# EAGLE schematic usb-interface (EAGLE 9.6.2)
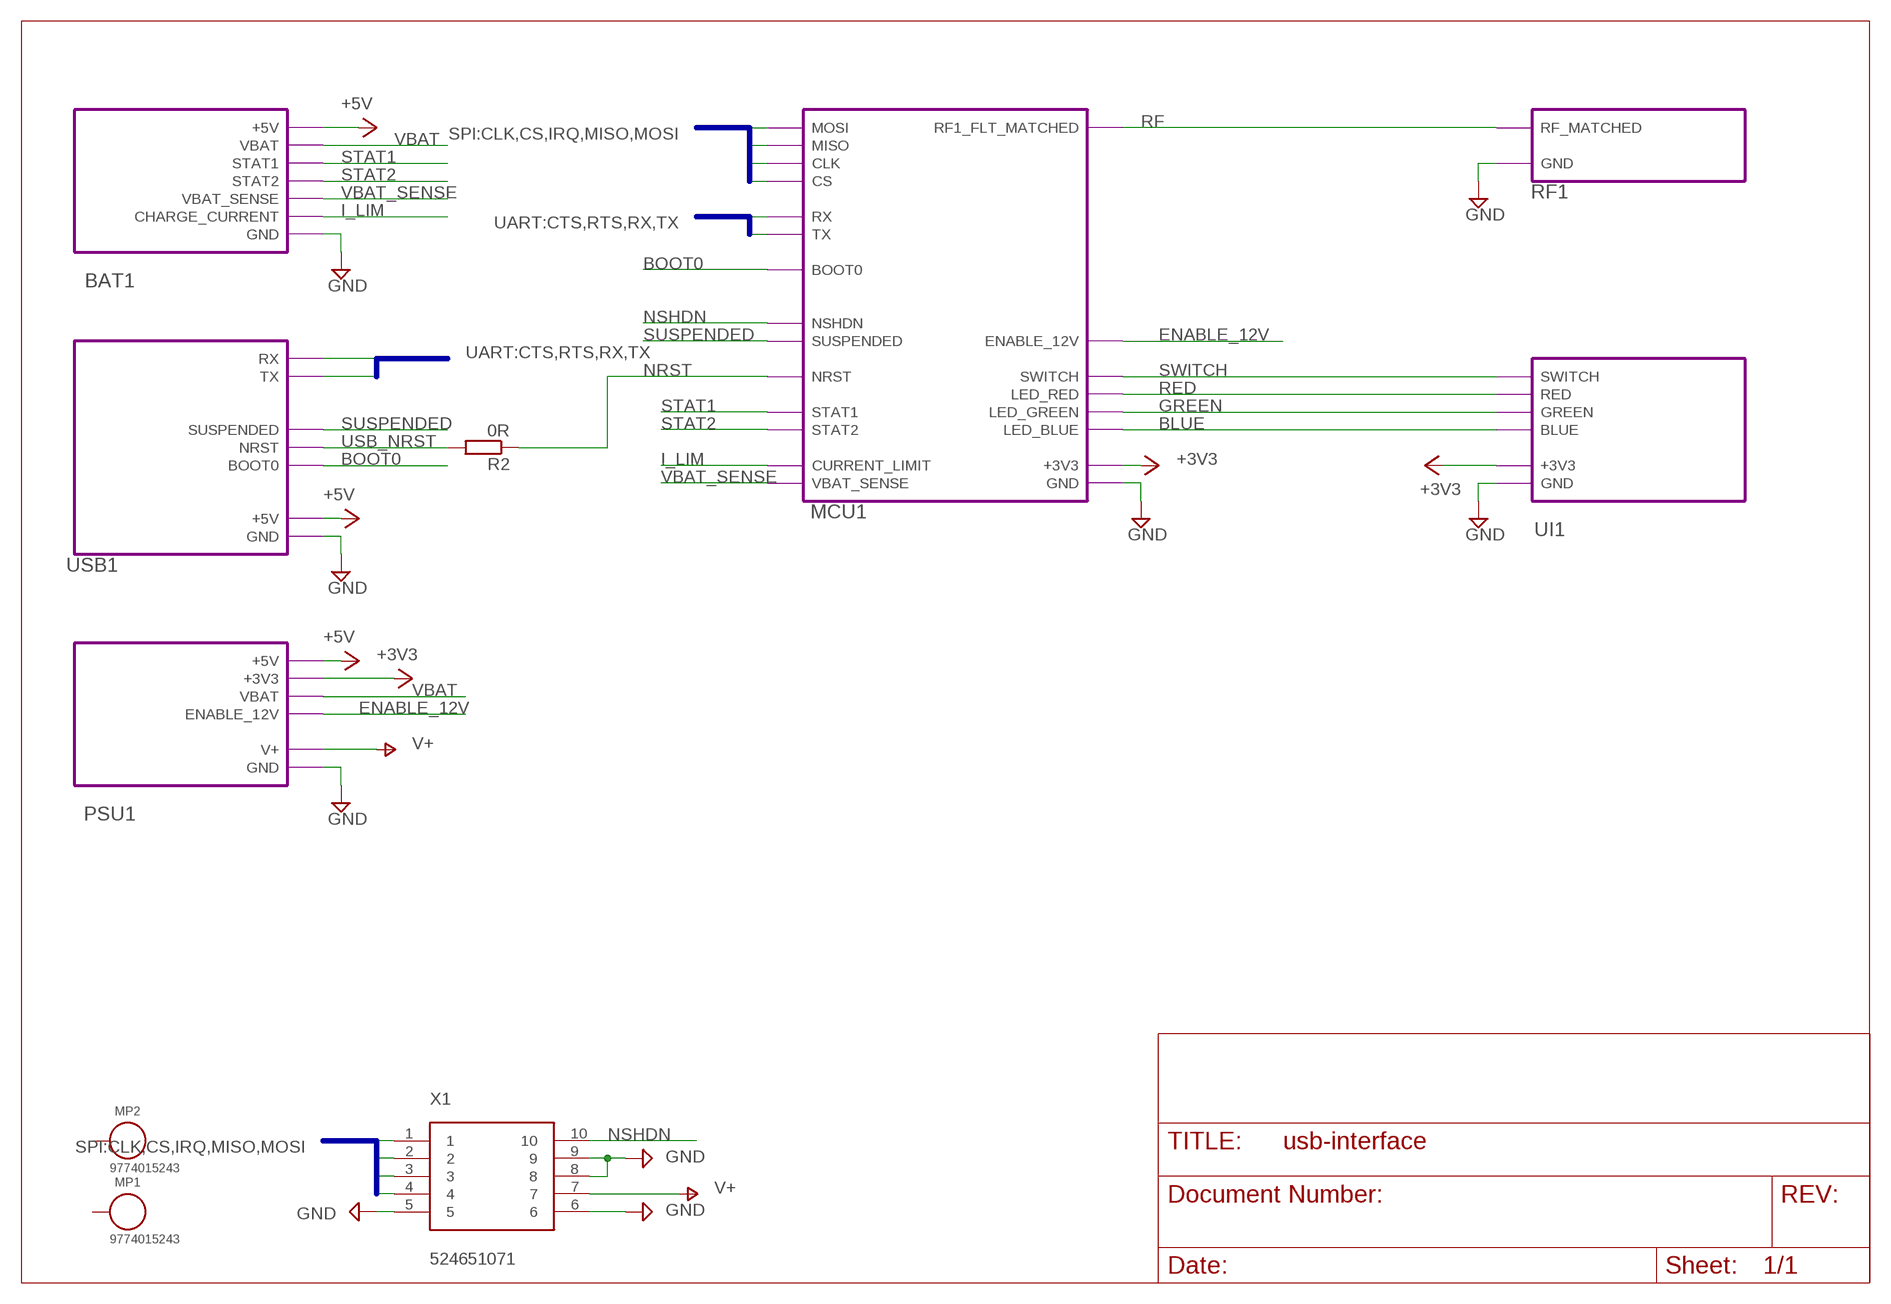
[diagram p0: schematic, sheet 1]

## Parts
MP1  9774015243  WA-SMSI_9774XXX243_9774015243  [WA-SMSI_9774015243]
MP2  9774015243  WA-SMSI_9774XXX243_9774015243  [WA-SMSI_9774015243]
R2  0R  R-EU_R0402  [R0402]
X1  524651071  524651071SMD  [524651071]

## Module instances
BAT1 = BATTERY
RF1 = WIRELESS
PSU1 = POWERSUPPLY
MCU1 = MICROCONTROLLER
USB1 = USB
UI1 = INTERFACE

## Nets
+3V3: port MCU1.+3V3 PSU1.+3V3 UI1.+3V3
+5V: port USB1.+5V BAT1.+5V PSU1.+5V
BLUE: port MCU1.LED_BLUE UI1.BLUE
BOOT0: port MCU1.BOOT0 USB1.BOOT0
CLK: X1.3 ; port MCU1.CLK
CS: X1.4 ; port MCU1.CS
ENABLE_12V: port PSU1.ENABLE_12V MCU1.ENABLE_12V
GND: X1.5 X1.6 X1.8 X1.9 ; port MCU1.GND RF1.GND USB1.GND BAT1.GND PSU1.GND UI1.GND
GREEN: port MCU1.LED_GREEN UI1.GREEN
I_LIM: port MCU1.CURRENT_LIMIT BAT1.CHARGE_CURRENT
MISO: X1.2 ; port MCU1.MISO
MOSI: X1.1 ; port MCU1.MOSI
NRST: R2.1 ; port MCU1.NRST
NSHDN: X1.10 ; port MCU1.NSHDN
RED: port MCU1.LED_RED UI1.RED
RF [50Ohm]: port RF1.RF_MATCHED MCU1.RF1_FLT_MATCHED
RX: port MCU1.RX USB1.RX
STAT1: port MCU1.STAT1 BAT1.STAT1
STAT2: port MCU1.STAT2 BAT1.STAT2
SUSPENDED: port MCU1.SUSPENDED USB1.SUSPENDED
SWITCH: port MCU1.SWITCH UI1.SWITCH
TX: port MCU1.TX USB1.TX
USB_NRST: R2.2 ; port USB1.NRST
V+: X1.7 ; port PSU1.V+
VBAT: port PSU1.VBAT BAT1.VBAT
VBAT_SENSE: port MCU1.VBAT_SENSE BAT1.VBAT_SENSE
Unconnected: MP1.1 MP2.1

## Buses
SPI:CLK,CS,IRQ,MISO,MOSI
UART:CTS,RTS,RX,TX

## Library data of the parts
MP1 MP2 = Wurth_Assembly_WA-SMSI:WA-SMSI_9774XXX243: WA-SMSI SMT Steel Spacer, M2 Thread Internal PROPERTIES Material Steel Surface Tin GENERAL INFORMATION Operating Temperature -55 up to +150 °C PACKAGING PROPERTIES Packaging Bag;​ Tape and Reel Packaging Unit 1050 <https://katalog.we-online.de/media/images/v2/o92910v209%20Family_WA-SMSI_M2-M2.5.jpg> Details see: https://katalog.we-online.de/en/em/SMSI_SMT_STEEL_SPACER_M2_THREAD_INTERNAL Updated by Ella Wu 2020-05-18 2020(C) Wurth Elektronik; DATASHEET-URL: https://www.we-online.de/katalog/datasheet/9774015243.pdf; INNER-DIAMETER: 2.8mm; INNER-THREAD-LENGTH: -; OUTER-DIAMETER: 4.35mm; PART-NUMBER: 9774015243; PIN-LENGTH: 1.5mm; THREAD: M2
R2 = rcl:R-EU_: RESISTOR, European symbol; SPICEPREFIX: R
X1 = connectors:524651071: 524651071 SlimStack Board-to-Board Connector, 0.80mm Pitch, Floating Series, Rigid Type Receptacle, 4.50 to 7.00mm Mated Height, 10 Circuits, without Boss

## Module BATTERY
Ports: GND(io) CHARGE_CURRENT(io) VBAT_SENSE(io) +5V(io) VBAT(io) STAT1(io) STAT2(io)
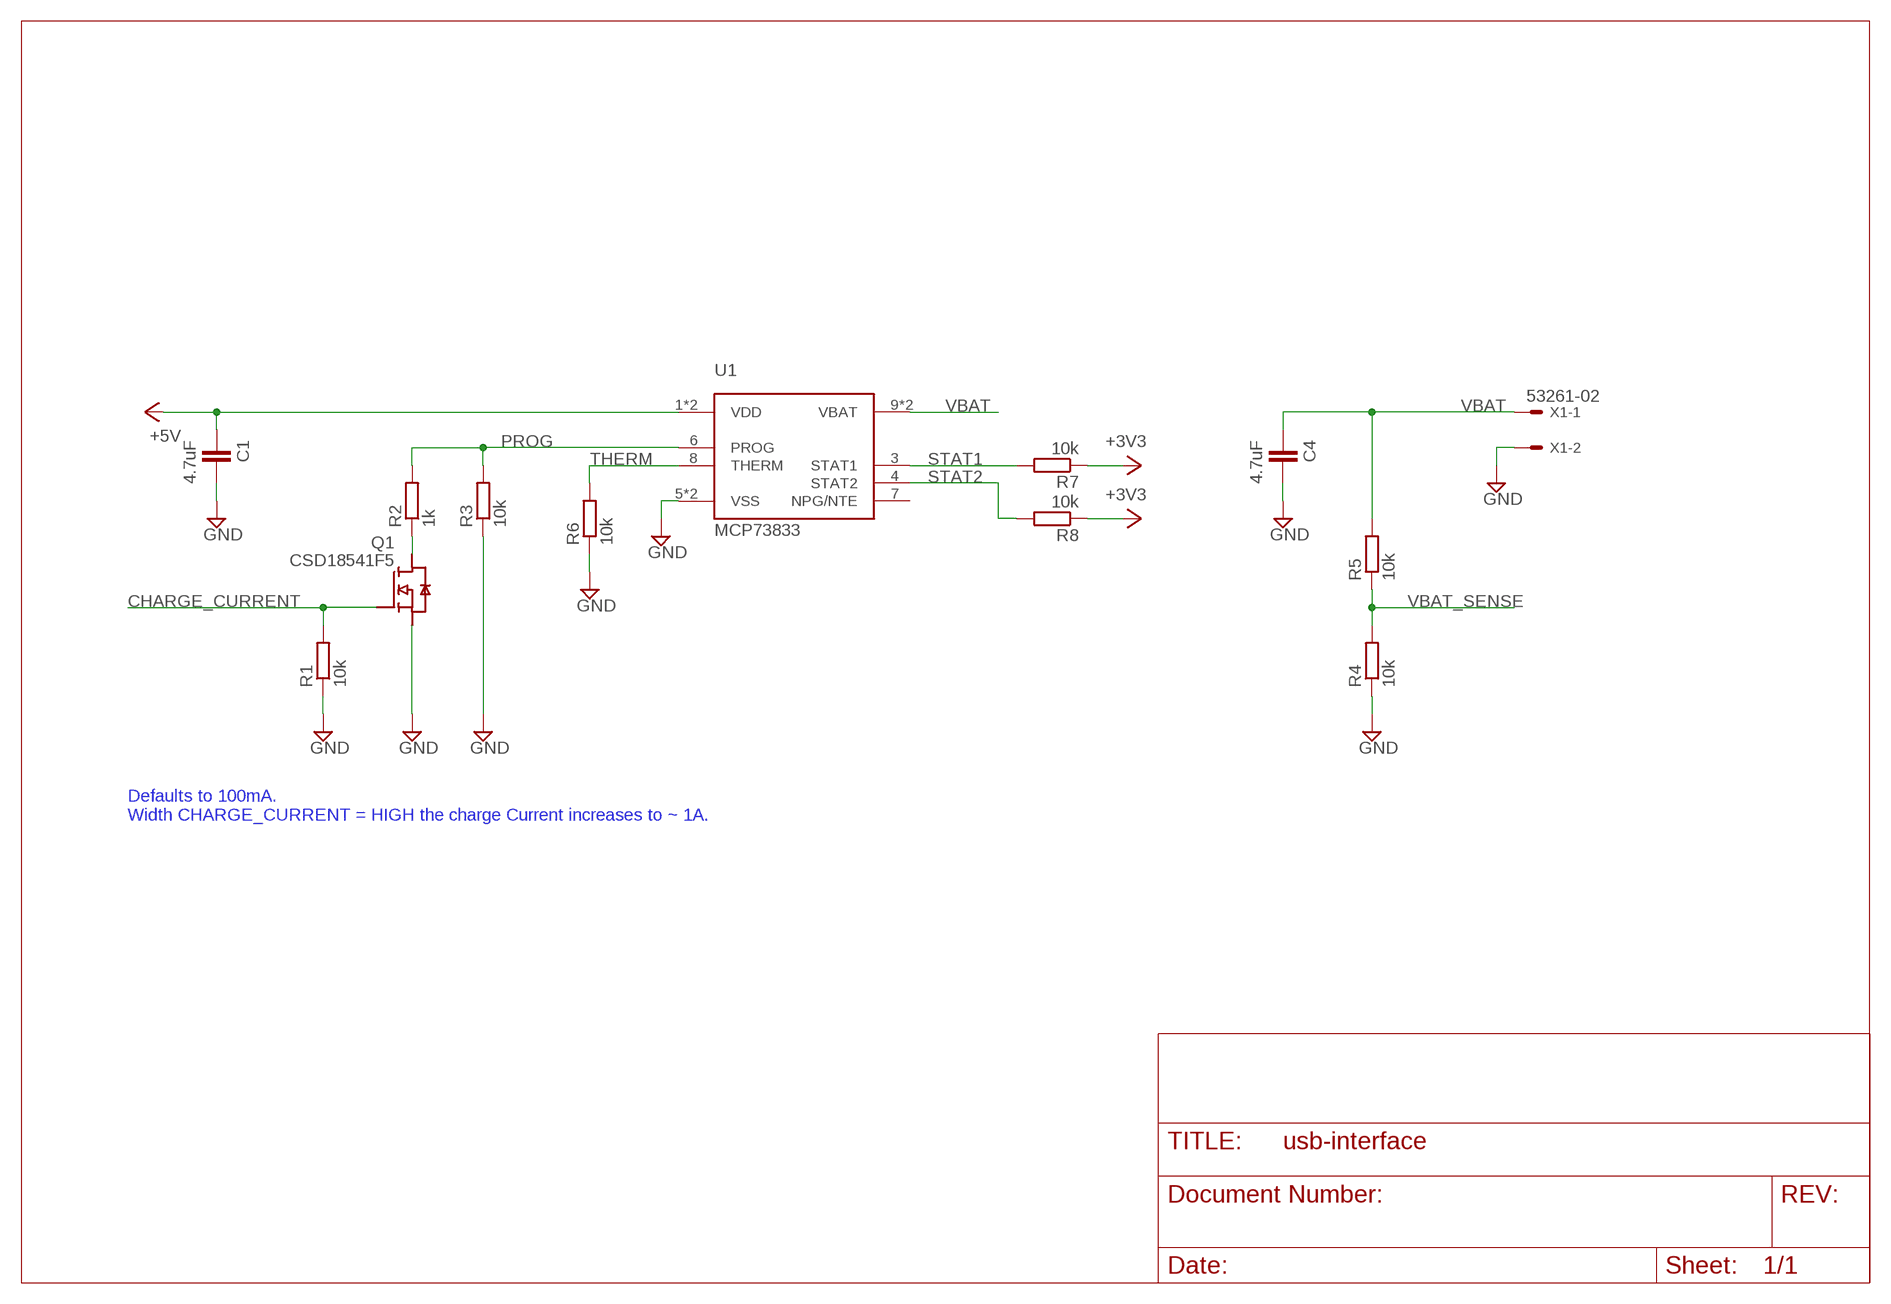
[diagram p1: schematic, module BATTERY, sheet 1]

### Parts
C1  4.7uF  C-EUC0603K  [C0603K]
C4  4.7uF  C-EUC0603K  [C0603K]
Q1  CSD18541F5  CSD18541F5LGA  [CSD18541F5]
R1  10k  R-EU_R0402  [R0402]
R2  1k  R-EU_R0402  [R0402]
R3  10k  R-EU_R0402  [R0402]
R4  10k  R-EU_R0402  [R0402]
R5  10k  R-EU_R0402  [R0402]
R6  10k  R-EU_R0402  [R0402]
R7  10k  R-EU_R0402  [R0402]
R8  10k  R-EU_R0402  [R0402]
U1  MCP73833  MCP73833/4DFN10  [SON50P300X300X100-11T140X220N]
X1  53261-02  [53261-02]

### Nets
+3V3: R7.1 R8.1
+5V: C1.1 U1.1(VDD) U1.2(VDD)
CHARGE_CURRENT: Q1.1(G) R1.2
GND: C1.2 C4.2 Q1.2(S) R1.1 R3.1 R4.1 R6.1 U1.5(VSS) U1.11(VSS) X1.2
N$1: Q1.3(D) R2.1
PROG: R2.2 R3.2 U1.6(PROG)
STAT1: R7.2 U1.3(STAT1)
STAT2: R8.2 U1.4(STAT2)
THERM: R6.2 U1.8(THERM)
VBAT: C4.1 R5.2 U1.9(VBAT) U1.10(VBAT) X1.1
VBAT_SENSE: R4.2 R5.1
Unconnected: U1.7(NPG/NTE)

### Notes on the sheet
- Defaults to 100mA.
  Width CHARGE_CURRENT = HIGH the charge Current increases to ~ 1A.

### Library data of the parts
C1 C4 = rcl:C-EU: CAPACITOR, European symbol; SPICEPREFIX: C
Q1 = spectrometer:CSD18541F5: CSD18541F5 This 54-mΩ, 60-V, N-Channel FemtoFETTM MOSFET technology is designed and optimized to minimize the footprint in many space constrained industrial load switch applications. This technology is capable of replacing standard small signal MOSFETs while providing a significant reduction in footprint size.
R1-R8 = rcl:R-EU_: RESISTOR, European symbol; SPICEPREFIX: R
U1 = spectrometer:MCP73833/4: MCP73833/4 The MCP73833/4 is a highly advanced linear charge management controller for use in space-limited, cost sensitive applications. The MCP73833/4 is available in a 10-Lead, 3 mm x 3 mm DFN package or a 10-Lead, MSOP package. Along with its small physical size, the low number of external components required makes the MCP73833/4 ideally suited for portable applications. For applications charging from a USB port, the MCP73833/4 can adhere to all the specifications governing the USB power bus. The MCP73833/4 employs a constant current/constant voltage charge algorithm with selectable precondition- ing and charge termination. The constant voltage regulation is fixed with four available options: 4.20V, 4.35V, 4.40V, or 4.50V, to accomodate new, emerging battery charging requirements. The constant current value is set with one external resistor. The MCP73833/ 4 limits the charge current based on die temperature during high power or high ambient conditions. This thermal regulation optimizes the charge cycle time while maintaining device reliability.
X1 = connectors:53?-02: CONNECTOR wire to board 1.25 mm (.049 inch) pitch header; MF: MOLEX; OC_FARNELL: 1125373; OC_NEWARK: unknown

## Module WIRELESS
Ports: RF_MATCHED(io) GND(io)
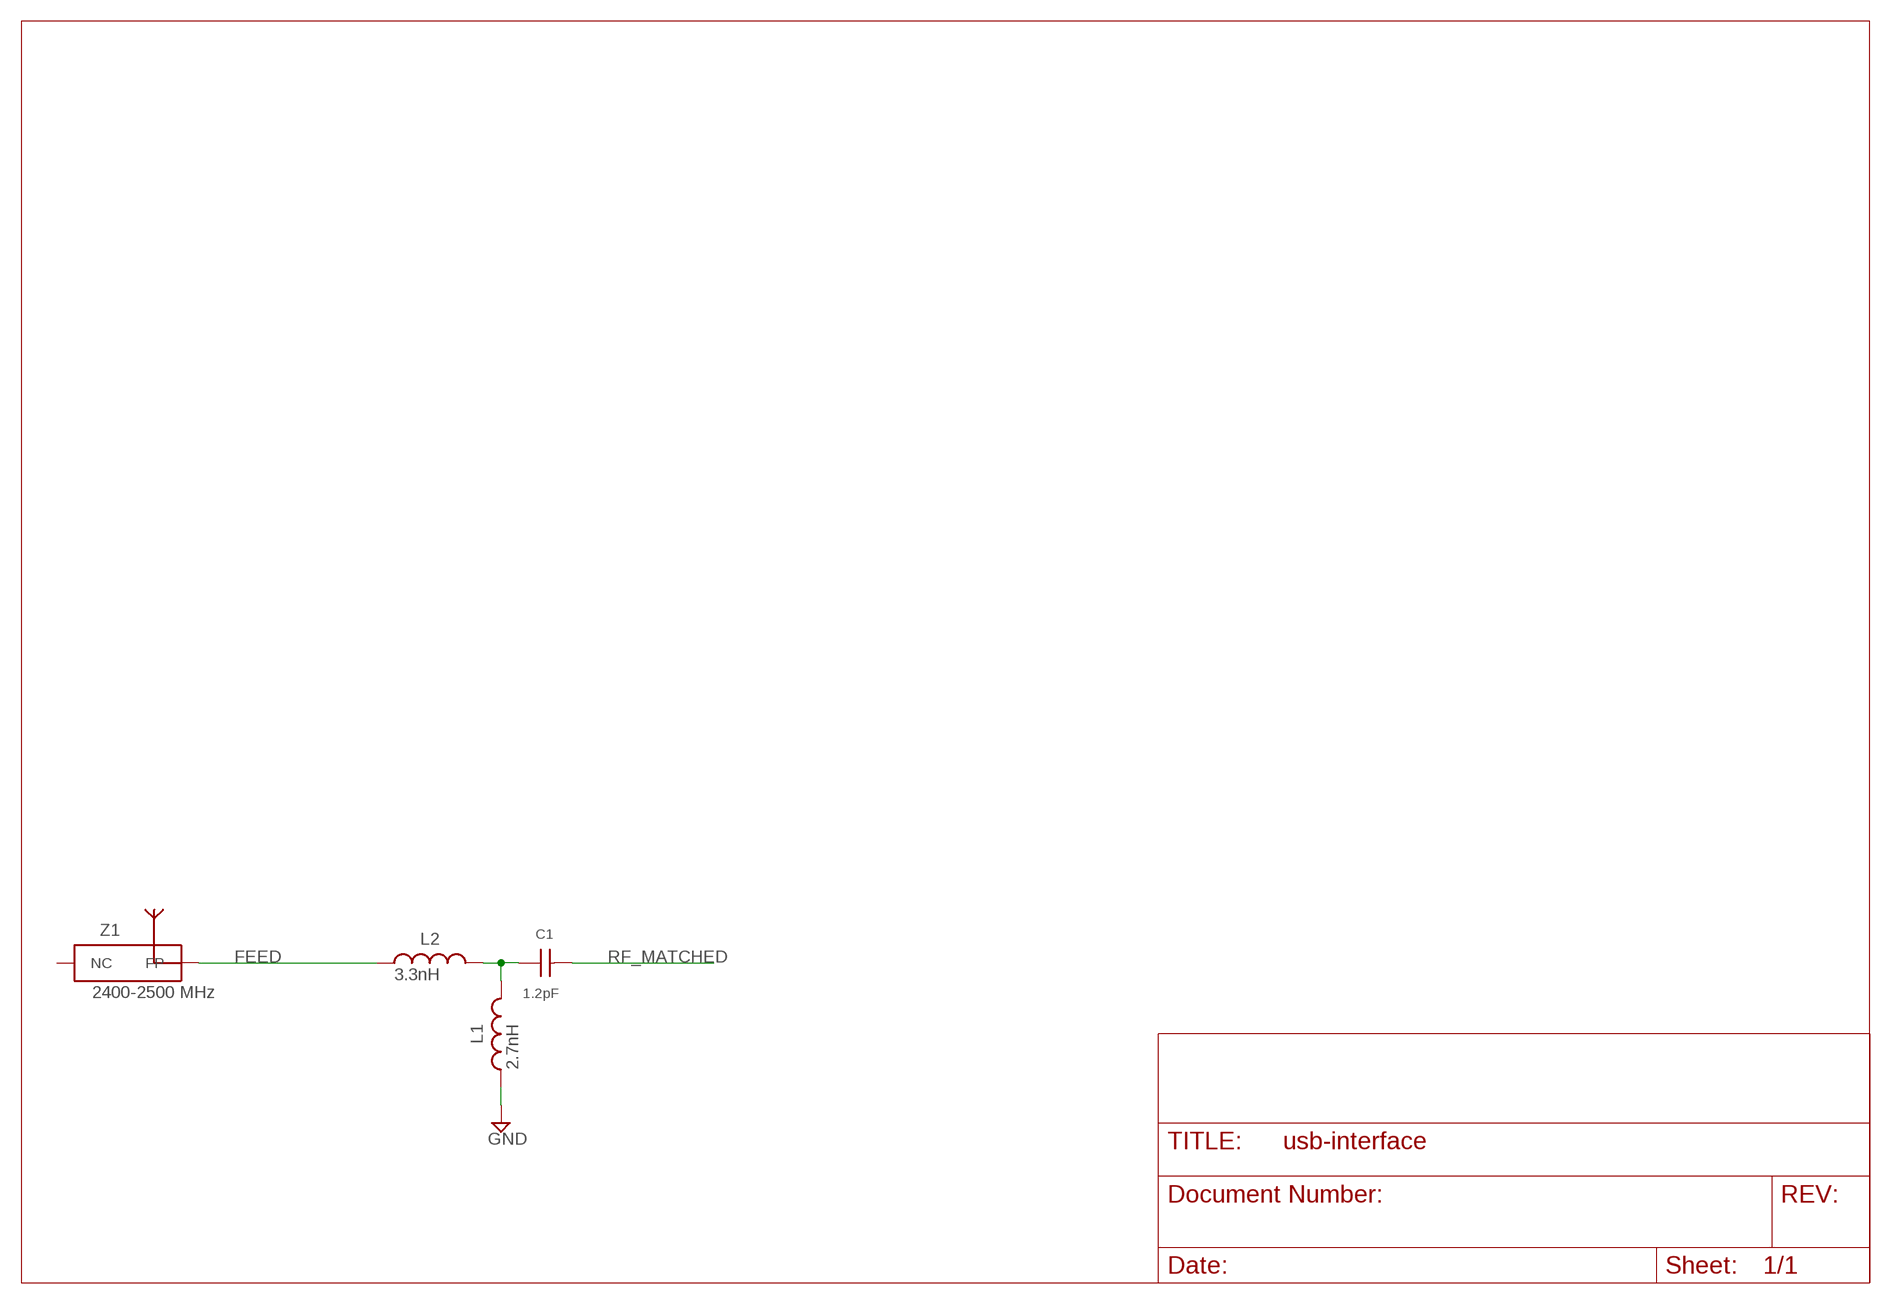
[diagram p2: schematic, module WIRELESS, sheet 1]

### Parts
C1  1.2pF  WCAP-CSRF_0201_885392004003  [WCAP-CSRF_0201]
L1  2.7nH  WE-TCI_0201_744900027  [WE-TCI_0201]
L2  3.3nH  WE-TCI_0201_744900033  [WE-TCI_0201]
Z1  2400-2500 MHz  WE-MCA_7488930245  [WE-MCA_7488930245]

### Nets
FEED [50Ohm]: L2.1 Z1.1(FP)
GND: L1.1
MATCH [50Ohm]: C1.1 L1.2 L2.2
RF_MATCHED: C1.2
Unconnected: Z1.2(NC)

### Library data of the parts
C1 = Wurth_Capacitors_WCAP-CSRF:WCAP-CSRF_0201: WCAP-CSRF MLCCs High Frequency Characteristics High frequency product series Mounting style: SMT-Chip Ceramic: NP0 (Class I) Capacitance range: 0.2 pF ‒ 33 pF Temperature Coefficient: ±30 ppm/°C Voltage range (UR): 25 ‒ 50 V(DC) Operating temperature: -55 °C up to + 125 °C Sizes: 0201 / 0402 Termination: Cu/Ni/Sn Recommended soldering: Reflow soldering Applications THigh frequency applications Antenna matching <https://www.we-online.com/catalog/media/o164338v209%20Family_WE-MLCC_0805_weiss.jpg> Details see: https://www.we-online.com/catalog/en/WCAP-CSRF/ Updated by yingchun,Shan;2020-03-10 2020(C) Würth Elektronik; CERAMIC-TYPE: NP0 Class I; DATASHEET-URL: https://www.we-online.com/catalog/datasheet/885392004003.pdf; H: 0.3mm; PART-NUMBER: 885392004003; QMIN: 400+20C; RISO: 10GOhm; TECHNICAL-REFERENCE: NP002011R2B025DFCT1R000; TOL-C: ±0.1pF; VR: 25V(DC)
L1 = Wurth_Signal & Communications_WE-TCI:WE-TCI_0201: WE-TCI Thinfilm Chip Inductor Characteristics High self resonant frequency Tight tolerances of 2% (1% on request) or ± 0.1 nH and small inductance values Outstanding temperature stability In high frequency circuit the inductance is very stable Small inductance values Recommended solder profile: Reflow Operating temperature: –40 ºC to +125 ºC Applications Mobile phone Pagers GPS products Wireless LAN Communication appliances RF Transceiver Module <https://katalog.we-online.com/media/images/v2/o14861v209%20Family_WE-TCI.jpg> Details see: https://katalog.we-online.com/en/pbs/WE-TCI Updated by Ella Wu 2019-08-20 2019 (C) Wurth Elektronik; DATASHEET-URL: https://katalog.we-online.com/pbs/datasheet/744900027.pdf; FRES: 8GHz; IR: 150mA; MOUNT: SMT; PART-NUMBER: 744900027; Q-FACTOR: 8; RDC: 0.8Ohm
L2 = Wurth_Signal & Communications_WE-TCI:WE-TCI_0201: WE-TCI Thinfilm Chip Inductor Characteristics High self resonant frequency Tight tolerances of 2% (1% on request) or ± 0.1 nH and small inductance values Outstanding temperature stability In high frequency circuit the inductance is very stable Small inductance values Recommended solder profile: Reflow Operating temperature: –40 ºC to +125 ºC Applications Mobile phone Pagers GPS products Wireless LAN Communication appliances RF Transceiver Module <https://katalog.we-online.com/media/images/v2/o14861v209%20Family_WE-TCI.jpg> Details see: https://katalog.we-online.com/en/pbs/WE-TCI Updated by Ella Wu 2019-08-20 2019 (C) Wurth Elektronik; DATASHEET-URL: https://katalog.we-online.com/pbs/datasheet/744900033.pdf; FRES: 6GHz; IR: 150mA; MOUNT: SMT; PART-NUMBER: 744900033; Q-FACTOR: 8; RDC: 1Ohm
Z1 = Wurth_Signal & Communications_WE-MCA:WE-MCA_7488930245: WE-MCA Antennas Characteristics SMD Multilayer Chip Antenna Extremely low profile Very light component Power capacity: 5 W max. Omni-directional Operating temperature: –40 °C to +85 °C High gain Applications RF applications WLAN Home RF (868 MHz) Bluetooth applications GSM 900 ISM 868/2400 <https://katalog.we-online.com/media/images/v2/o14819v209%20Family_WE-MCA.jpg> Details see: https://katalog.we-online.com/en/pbs/WE-MCA Updated by Ella Wu 2019-08-16 2019 (C) Wurth Elektronik; DATASHEET-URL: https://katalog.we-online.com/pbs/datasheet/7488930245.pdf; MOUNT: SMT; PART-NUMBER: 7488930245; PEAK-GAIN: 0.5dB; VSWR: 2; Z: 50Ohm

## Module POWERSUPPLY
Ports: GND(io) +5V(io) +3V3(io) ENABLE_12V(io) VBAT(io) V+(io)
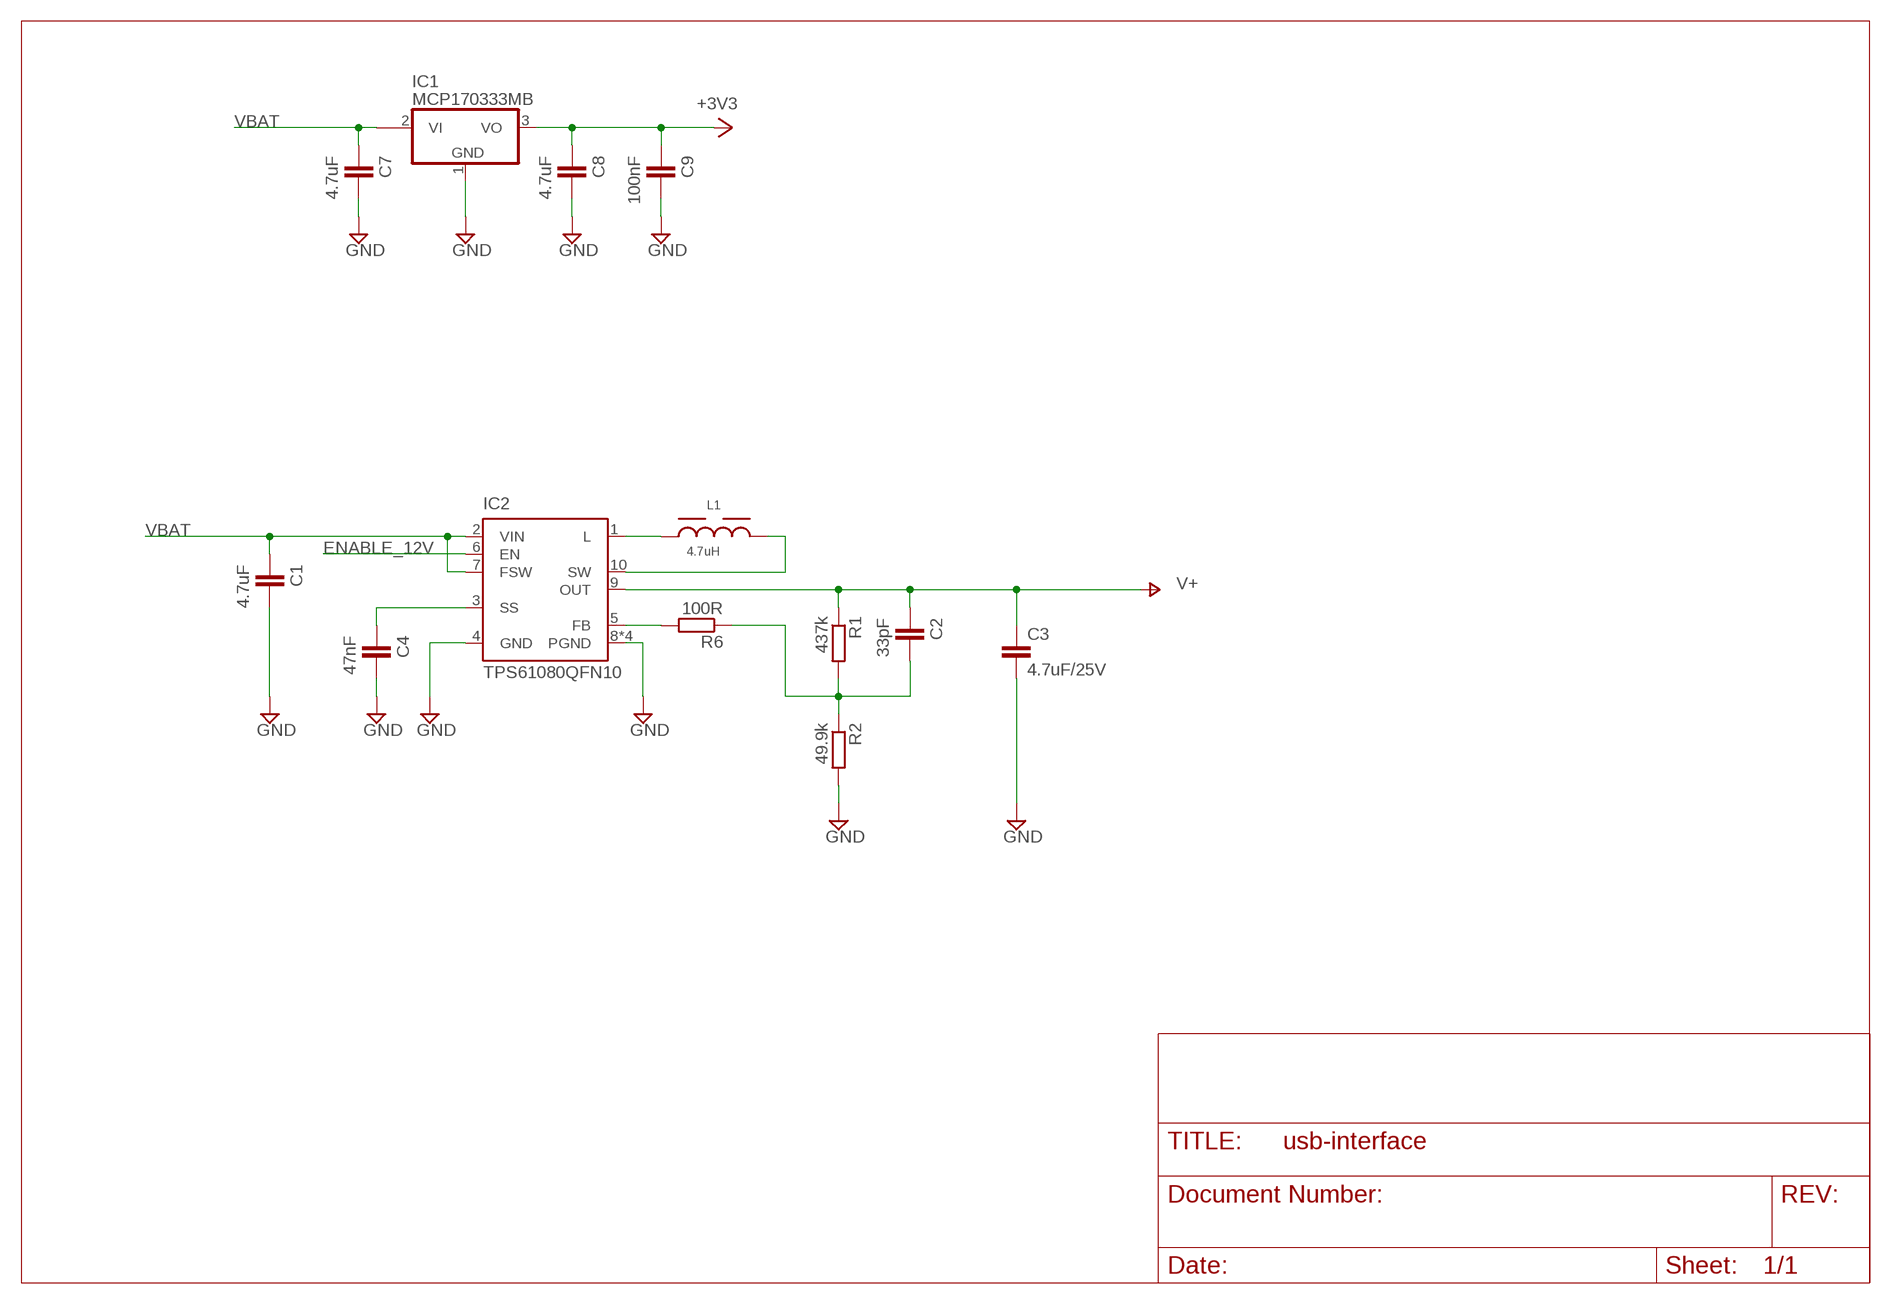
[diagram p3: schematic, module POWERSUPPLY, sheet 1]

### Parts
C1  4.7uF  C-EUC0603K  [C0603K]
C2  33pF  C-EUC0402  [C0402]
C3  4.7uF/25V  C-EUC1210  [C1210]
C4  47nF  C-EUC0402  [C0402]
C7  4.7uF  C-EUC0603K  [C0603K]
C8  4.7uF  C-EUC0603K  [C0603K]
C9  100nF  C-EUC0402  [C0402]
IC1  MCP170333MB  [SOT89]
IC2  TPS61080QFN10  [S-PDSO-N10]
L1  4.7uH  WE-LQS_2512_74404024047  [WE-LQS_2512]
R1  437k  R-EU_R0402  [R0402]
R2  49.9k  R-EU_R0402  [R0402]
R6  100R  R-EU_R0402  [R0402]

### Nets
+3V3: C8.1 C9.1 IC1.3(VO)
ENABLE_12V: IC2.6(EN)
GND: C1.2 C3.2 C4.2 C7.2 C8.2 C9.2 IC1.1(GND) IC2.4(GND) IC2.8(PGND) IC2.PP(PGND) IC2.PP@1(PGND) IC2.PP@2(PGND) R2.2
N$1: IC2.1(L) L1.1
N$2: IC2.10(SW) L1.2
N$3: C4.1 IC2.3(SS)
N$4: C2.2 R1.2 R2.1 R6.1
N$5: IC2.5(FB) R6.2
V+: C2.1 C3.1 IC2.9(OUT) R1.1
VBAT: C1.1 C7.1 IC1.2@1(VI1) IC2.2(VIN) IC2.7(FSW)
Unconnected: IC1.2(VI)

### Library data of the parts
C1-C4 C7-C9 = rcl:C-EU: CAPACITOR, European symbol; SPICEPREFIX: C
IC1 = linear:MCP1703*: 250 mA, 16V, Low Quiescent Current LDO Regulator Source: http://ww1.microchip.com/downloads/en/DeviceDoc/22049b.pdf
IC2 = spectrometer:TPS6108*: HIGH VOLTAGE DC/DC BOOST CONVERTER WITH 0.5-A/1.3-A INTEGRATED SWITCH Source: www.ti.com .. tps61081[1].pdf; MPN: TPS61080DRCT; OC_FARNELL: 1412517; OC_NEWARK: 30M1831
L1 = Wurth_Power Magnetics_WE-LQS:WE-LQS_2512: WE-LQS SMD Power Inductor Characteristics Compact design Power Inductor 1.7 times more current than compared to an unshielded version Robust construction Low RDC Magnetically shielded by use of a magnetic resin Operating temperature: -40°C to +125°C Applications Integrated DC/DC Converters Switching controllers which require high efficiency Portable power (PDA, Smartphones, Digital Cameras, TVs, LCD etc.) Embedded Laptops and PCs Big sizes can be used in shock resisting circuits <https://katalog.we-online.com/media/images/v2/o14807v209%20Family_WE-LQS.jpg> Details see: https://katalog.we-online.com/en/pbs/WE-LQS Updated by Ella Wu 2020-03-18 2020 (C) Wurth Elektronik; DATASHEET-URL: https://www.we-online.com/catalog/datasheet/74404024047.pdf; FRES: 52MHz; IR: 1.12A; ISAT: 1.2A; PART-NUMBER: 74404024047; RDC: 173mOhm
R1 R2 R6 = rcl:R-EU_: RESISTOR, European symbol; SPICEPREFIX: R

## Module MICROCONTROLLER
Ports: RF1_FLT_MATCHED(io) GND(io) MOSI(io) CLK(io) MISO(io) CS(io) RX(io) TX(io) +3V3(io) BOOT0(io) NSHDN(io) NRST(io) SUSPENDED(io) VBAT_SENSE(io) CURRENT_LIMIT(io) STAT1(io) STAT2(io) ENABLE_12V(io) SWITCH(io) LED_RED(io) LED_GREEN(io) LED_BLUE(io)
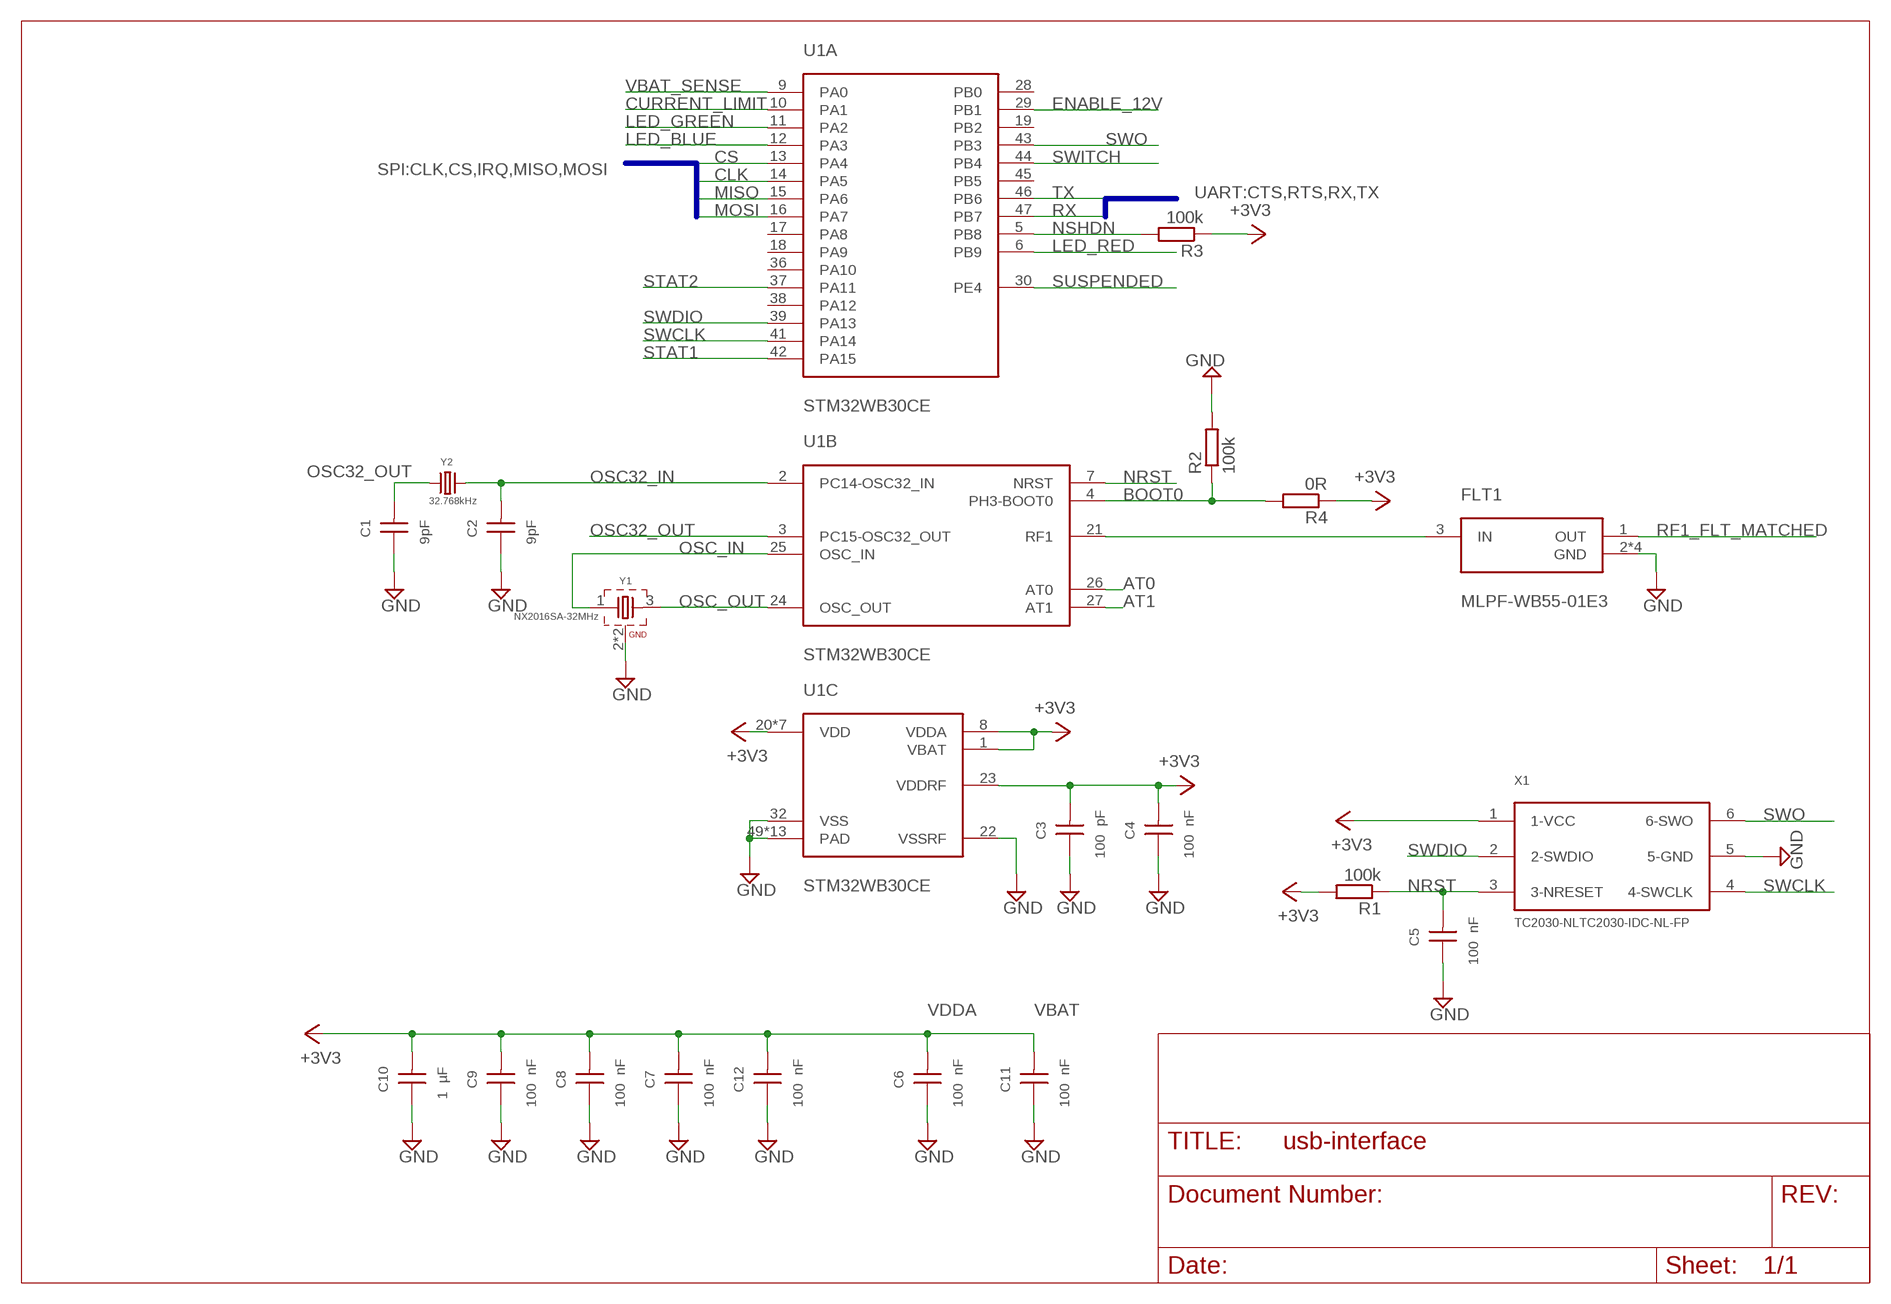
[diagram p4: schematic, module MICROCONTROLLER, sheet 1]

### Parts
C1  9pF  WCAP-CSRF_0201_885392004010  [WCAP-CSRF_0201]
C2  9pF  WCAP-CSRF_0201_885392004010  [WCAP-CSRF_0201]
C3  100 pF  WCAP-CSGP_0402_885012005013_10V(DC)  [WCAP-CSGP_0402]
C4  100 nF  WCAP-CSGP_0402_885012105010_10V(DC)  [WCAP-CSGP_0402]
C5  100 nF  WCAP-CSGP_0402_885012105010_10V(DC)  [WCAP-CSGP_0402]
C6  100 nF  WCAP-CSGP_0402_885012105010_10V(DC)  [WCAP-CSGP_0402]
C7  100 nF  WCAP-CSGP_0402_885012105010_10V(DC)  [WCAP-CSGP_0402]
C8  100 nF  WCAP-CSGP_0402_885012105010_10V(DC)  [WCAP-CSGP_0402]
C9  100 nF  WCAP-CSGP_0402_885012105010_10V(DC)  [WCAP-CSGP_0402]
C10  1 µF  WCAP-CSGP_0402_885012105012_10V(DC)  [WCAP-CSGP_0402]
C11  100 nF  WCAP-CSGP_0402_885012105010_10V(DC)  [WCAP-CSGP_0402]
C12  100 nF  WCAP-CSGP_0402_885012105010_10V(DC)  [WCAP-CSGP_0402]
FLT1  MLPF-WB55-01E3  MLPF-WB55-01E3CSP  [CSP-6]
R1  100k  R-EU_R0402  [R0402]
R2  100k  R-EU_R0402  [R0402]
R3  100k  R-EU_R0402  [R0402]
R4  0R  R-EU_R0402  [R0402]
U1  STM32WB30CE  STM32WB30CEUFQFPN48  [QFN50P700X700X60-49T560N]
X1  TC2030-NLTC2030-IDC-NL-FP  [TC2030-NL]
Y1  NX2016SA-32MHz  WE-XTAL_IQXC-42_830059597  [WE-XTAL_IQXC-42]
Y2  32.768kHz  WE-XTAL_IQXC-25_830062558  [WE-XTAL_IQXC-25]

### Nets
+3V3: C3.2 C4.2 C6.2 C7.2 C8.2 C9.2 C10.2 C11.2 C12.2 R1.2 R3.1 R4.1 U1.1(C:VBAT) U1.8(C:VDDA) U1.20(C:VDD) U1.23(C:VDDRF) U1.31(C:VDD) U1.33(C:VDD) U1.34(C:VDD) U1.35(C:VDD) U1.40(C:VDD) U1.48(C:VDD) X1.1(1-VCC)
AT0: U1.26(B:AT0)
AT1: U1.27(B:AT1)
BOOT0: R2.1 R4.2 U1.4(B:PH3-BOOT0)
CLK: U1.14(A:PA5)
CS: U1.13(A:PA4)
CURRENT_LIMIT: U1.10(A:PA1)
ENABLE_12V: U1.29(A:PB1)
GND: C1.1 C2.1 C3.1 C4.1 C5.1 C6.1 C7.1 C8.1 C9.1 C10.1 C11.1 C12.1 FLT1.2(GND) FLT1.4(GND) FLT1.5(GND) FLT1.6(GND) R2.2 U1.22(C:VSSRF) U1.32(C:VSS) U1.49(C:PAD) U1.P$1(C:PAD) U1.P$2(C:PAD) U1.P$3(C:PAD) U1.P$4(C:PAD) U1.P$5(C:PAD) U1.P$6(C:PAD) U1.P$7(C:PAD) U1.P$8(C:PAD) U1.P$9(C:PAD) U1.P$10(C:PAD) U1.P$11(C:PAD) U1.P$12(C:PAD) X1.5(5-GND) Y1.2(GND) Y1.4(GND)
LED_BLUE: U1.12(A:PA3)
LED_GREEN: U1.11(A:PA2)
LED_RED: U1.6(A:PB9)
MISO: U1.15(A:PA6)
MOSI: U1.16(A:PA7)
N$1: FLT1.3(IN) U1.21(B:RF1)
NRST: C5.2 R1.1 U1.7(B:NRST) X1.3(3-NRESET)
NSHDN: R3.2 U1.5(A:PB8)
OSC32_IN: C2.2 U1.2(B:PC14-OSC32_IN) Y2.2
OSC32_OUT: C1.2 U1.3(B:PC15-OSC32_OUT) Y2.1
OSC_IN: U1.25(B:OSC_IN) Y1.1
OSC_OUT: U1.24(B:OSC_OUT) Y1.3
RF1_FLT_MATCHED [50Ohm]: FLT1.1(OUT)
RX: U1.47(A:PB7)
STAT1: U1.42(A:PA15)
STAT2: U1.37(A:PA11)
SUSPENDED: U1.30(A:PE4)
SWCLK: U1.41(A:PA14) X1.4(4-SWCLK)
SWDIO: U1.39(A:PA13) X1.2(2-SWDIO)
SWITCH: U1.44(A:PB4)
SWO: U1.43(A:PB3) X1.6(6-SWO)
TX: U1.46(A:PB6)
VBAT_SENSE: U1.9(A:PA0)
Unconnected: U1.17(A:PA8) U1.18(A:PA9) U1.19(A:PB2) U1.28(A:PB0) U1.36(A:PA10) U1.38(A:PA12) U1.45(A:PB5)

### Buses
SPI:CLK,CS,IRQ,MISO,MOSI
UART:CTS,RTS,RX,TX

### Notes on the sheet
- VDDA | VBAT

### Library data of the parts
C1 C2 = Wurth_Capacitors_WCAP-CSRF:WCAP-CSRF_0201: WCAP-CSRF MLCCs High Frequency Characteristics High frequency product series Mounting style: SMT-Chip Ceramic: NP0 (Class I) Capacitance range: 0.2 pF ‒ 33 pF Temperature Coefficient: ±30 ppm/°C Voltage range (UR): 25 ‒ 50 V(DC) Operating temperature: -55 °C up to + 125 °C Sizes: 0201 / 0402 Termination: Cu/Ni/Sn Recommended soldering: Reflow soldering Applications THigh frequency applications Antenna matching <https://www.we-online.com/catalog/media/o164338v209%20Family_WE-MLCC_0805_weiss.jpg> Details see: https://www.we-online.com/catalog/en/WCAP-CSRF/ Updated by yingchun,Shan;2020-03-10 2020(C) Würth Elektronik; CERAMIC-TYPE: NP0 Class I; DATASHEET-URL: https://www.we-online.com/catalog/datasheet/885392004010.pdf; H: 0.3mm; PART-NUMBER: 885392004010; QMIN: 400+20C; RISO: 10GOhm; TECHNICAL-REFERENCE: NP002019R0D025DFCT1R000; TOL-C: ±0.5pF; VR: 25V(DC)
C3 = Wurth_Capacitors_WCAP-CSGP:WCAP-CSGP_0402: WCAP-CSGP MLCCs 0402 General Purpose Characteristics High performance ceramic High electrical precision and stability ceramic especially for NP0 Minimal aging especially for NP0 Mounting style: SMT-Chip Ceramic: NP0 (Class I), X5R (Class II), X7R (Class II) Capacitance range: 1 pF ‒ 10 µF Temperature Coefficient: ±30 ppm/°C; ±0.54 % for NP0 ±15 % for X5R and X7R Voltage range (UR): 6.3 ‒ 100 V(DC) Operating temperature: -55 °C up to + 125 °C for NP0 and X7R -55 °C up to + 85 °C for X5R Termination: Cu/Ni/Sn Recommended soldering: Reflow soldering Applications Temperature compensation (NP0) Coupling Decoupling Bypass Smoothing Filtering Resonant circuit <https://www.we-online.com/catalog/media/o157810v209%20Family_WE-MLCC_0805_weiss.jpg> Details see: https://www.we-online.com/catalog/en/WCAP-CSGP-0402/ Updated by yingchun,Shan;2020-03-06 2020(C) Würth Elektronik; CERAMIC-TYPE: NP0 Class I; DATASHEET-URL: https://www.we-online.com/catalog/datasheet/885012005013.pdf; DF: -; H: 0.5mm; OPERATING-TEMPERATURE: -55 °C up to +125 °C; PART-NUMBER: 885012005013; QMIN: 1000; RISO: 10GOhm; TECHNICAL-REFERENCE: NP00402101J010DFCT10000; TOL-VALUE: ±5%; VR: 10V(DC)
C4-C9 C11 C12 = Wurth_Capacitors_WCAP-CSGP:WCAP-CSGP_0402: WCAP-CSGP MLCCs 0402 General Purpose Characteristics High performance ceramic High electrical precision and stability ceramic especially for NP0 Minimal aging especially for NP0 Mounting style: SMT-Chip Ceramic: NP0 (Class I), X5R (Class II), X7R (Class II) Capacitance range: 1 pF ‒ 10 µF Temperature Coefficient: ±30 ppm/°C; ±0.54 % for NP0 ±15 % for X5R and X7R Voltage range (UR): 6.3 ‒ 100 V(DC) Operating temperature: -55 °C up to + 125 °C for NP0 and X7R -55 °C up to + 85 °C for X5R Termination: Cu/Ni/Sn Recommended soldering: Reflow soldering Applications Temperature compensation (NP0) Coupling Decoupling Bypass Smoothing Filtering Resonant circuit <https://www.we-online.com/catalog/media/o157810v209%20Family_WE-MLCC_0805_weiss.jpg> Details see: https://www.we-online.com/catalog/en/WCAP-CSGP-0402/ Updated by yingchun,Shan;2020-03-06 2020(C) Würth Elektronik; CERAMIC-TYPE: X5R Class II; DATASHEET-URL: https://www.we-online.com/catalog/datasheet/885012105010.pdf; DF: 5%; H: 0.5mm; OPERATING-TEMPERATURE: -55 °C up to +85 °C; PART-NUMBER: 885012105010; QMIN: -; RISO: 5GOhm; TECHNICAL-REFERENCE: X5R0402104M010DFCT10000; TOL-VALUE: ±20%; VR: 10V(DC)
C10 = Wurth_Capacitors_WCAP-CSGP:WCAP-CSGP_0402: WCAP-CSGP MLCCs 0402 General Purpose Characteristics High performance ceramic High electrical precision and stability ceramic especially for NP0 Minimal aging especially for NP0 Mounting style: SMT-Chip Ceramic: NP0 (Class I), X5R (Class II), X7R (Class II) Capacitance range: 1 pF ‒ 10 µF Temperature Coefficient: ±30 ppm/°C; ±0.54 % for NP0 ±15 % for X5R and X7R Voltage range (UR): 6.3 ‒ 100 V(DC) Operating temperature: -55 °C up to + 125 °C for NP0 and X7R -55 °C up to + 85 °C for X5R Termination: Cu/Ni/Sn Recommended soldering: Reflow soldering Applications Temperature compensation (NP0) Coupling Decoupling Bypass Smoothing Filtering Resonant circuit <https://www.we-online.com/catalog/media/o157810v209%20Family_WE-MLCC_0805_weiss.jpg> Details see: https://www.we-online.com/catalog/en/WCAP-CSGP-0402/ Updated by yingchun,Shan;2020-03-06 2020(C) Würth Elektronik; CERAMIC-TYPE: X5R Class II; DATASHEET-URL: https://www.we-online.com/catalog/datasheet/885012105012.pdf; DF: 15%; H: 0.5mm; OPERATING-TEMPERATURE: -55 °C up to +85 °C; PART-NUMBER: 885012105012; QMIN: -; RISO: 0.05GOhm; TECHNICAL-REFERENCE: X5R0402105M010DFCT10000; TOL-VALUE: ±20%; VR: 10V(DC)
FLT1 = spectrometer:MLPF-WB55-01E3: MLPF-WB55-01E3
R1-R4 = rcl:R-EU_: RESISTOR, European symbol; SPICEPREFIX: R
U1 = spectrometer:STM32WB30CE: STM32WB30CE The STM32WB50CG and STM32WB30CE multiprotocol wireless and ultra-low-power device embeds a powerful and ultra-low-power radio compliant with the Bluetooth® Low Energy SIG specification v5.0 or with IEEE 802.15.4-2011. It contains a dedicated Arm® Cortex® -M0+ for performing all the real-time low layer operation. The devices are designed to be extremely low-power and are based on the high-performance Arm® Cortex®-M4 32-bit RISC core operating at a frequency of up to 64 MHz. The Cortex®-M4 core features a Floating point unit (FPU) single precision that supports all Arm® single-precision data-processing instructions and data types. It also implements a full set of DSP instructions and a memory protection unit (MPU) that enhances application security. Enhanced inter-processor communication is provided by the IPCC with six bidirectional channels. The HSEM provides hardware semaphores used to share common resources between the two processors. The devices embed high-speed memories (1 Mbyte of Flash memory for STM32WB50xx, 512 Kbytes for STM32WB30xx, 128 Kbytes of SRAM for STM32WB50xx, 96 Kbytes for STM32WB30xx) and an extensive range of enhanced I/Os and peripherals. Direct data transfer between memory and peripherals and from memory to memory is supported by seven DMA channels with a full flexible channel mapping by the DMAMUX peripheral. The devices feature several mechanisms for embedded Flash memory and SRAM: readout protection, write protection and proprietary code readout protection. Portions of the memory can be secured for Cortex® -M0+ exclusive access. The AES encryption engine, PKA and RNG enable lower layer MAC and upper layer cryptography. A customer key storage feature may be used to keep the keys hidden. The devices offer a fast 16-bit ADC. These devices embed a low-power RTC, one advanced 16-bit timer, one general-purpose 32-bit timer, two general-purpose 16-bit timers, and two 16-bit low-power timers. The STM32WB50CG and STM32WB30CE also feature standard and advanced communication interfaces, namely one USART (ISO 7816, IrDA, Modbus and Smartcard mode), one I2C (SMBus/PMBus), one SPI up to 32 MHz. The STM32WB50CG and STM32WB30CE operate in the -10 to +85 °C (+105 °C junction) temperature range from a 2.0 to 3.6 V power supply. A comprehensive set of power-saving modes enables the design of low-power applications. The devices include independent power supplies for analog input for ADC. A VBAT dedicated supply allows the device to back up the LSE 32.768 KHz oscillator, the RTC and the backup registers, thus enabling the STM32WB50CG and STM32WB30CE to supply these functions even if the main VDD is not present through a CR2032-like battery, a Supercap or a small rechargeable battery. The STM32WB50CG and STM32WB30CE are available in a 48-pin UFQFPN package.
X1 = connectors:TC2030-NL
Y1 = Wurth_Quartz Crystals & Oscillators_WE-XTAL:WE-XTAL_IQXC-42: WE-XTAL Quartz Crystal Characteristics Industry standard packages <https://katalog.we-online.com/media/images/v2/o135919v209%20Family_WE-XTAL_IQXC-42.jpg> Details see: https://katalog.we-online.com/en/pbs/WE-XTAL Updated by Ella Wu , 2019-09-03 2019 (C) Wurth Elektronik; C-LOAD: 10pF; DATASHEET-URL: https://www.we-online.com/catalog/datasheet/830059597.pdf; MOUNT: SMT; PART-NUMBER: 830059597; STABILITY: 20ppm; TOLERANCE: ±15ppm; VALUE: 32MHz
Y2 = Wurth_Quartz Crystals & Oscillators_WE-XTAL:WE-XTAL_IQXC-25: WE-XTAL Watch Crystals Characteristics SMT and THT models Hermetically sealed Frequency: 32.768 kHz Tolerances down to ±10 ppm available Characteristics Microprocessor Real Time Clocks Test and Measurement Equipment Battery powered Applications <https://www.we-online.com/catalog/media/o162740v209%20Family_WE-XTAL_WatchCrystal.jpg> Details see: https://www.we-online.com/catalog/en/WE-XTAL_WATCHCRYSTAL Updated by Ella Wu, 2020-10-30 2020 (C) Wurth Elektronik; C-LOAD: 9pF; DATASHEET-URL: https://www.we-online.com/catalog/datasheet/830062558.pdf; MOUNT: SMT; PART-NUMBER: 830062558; TOLERANCE: ±10ppm

## Module USB
Ports: RX(io) TX(io) GND(io) +5V(io) NRST(io) BOOT0(io) SUSPENDED(io)
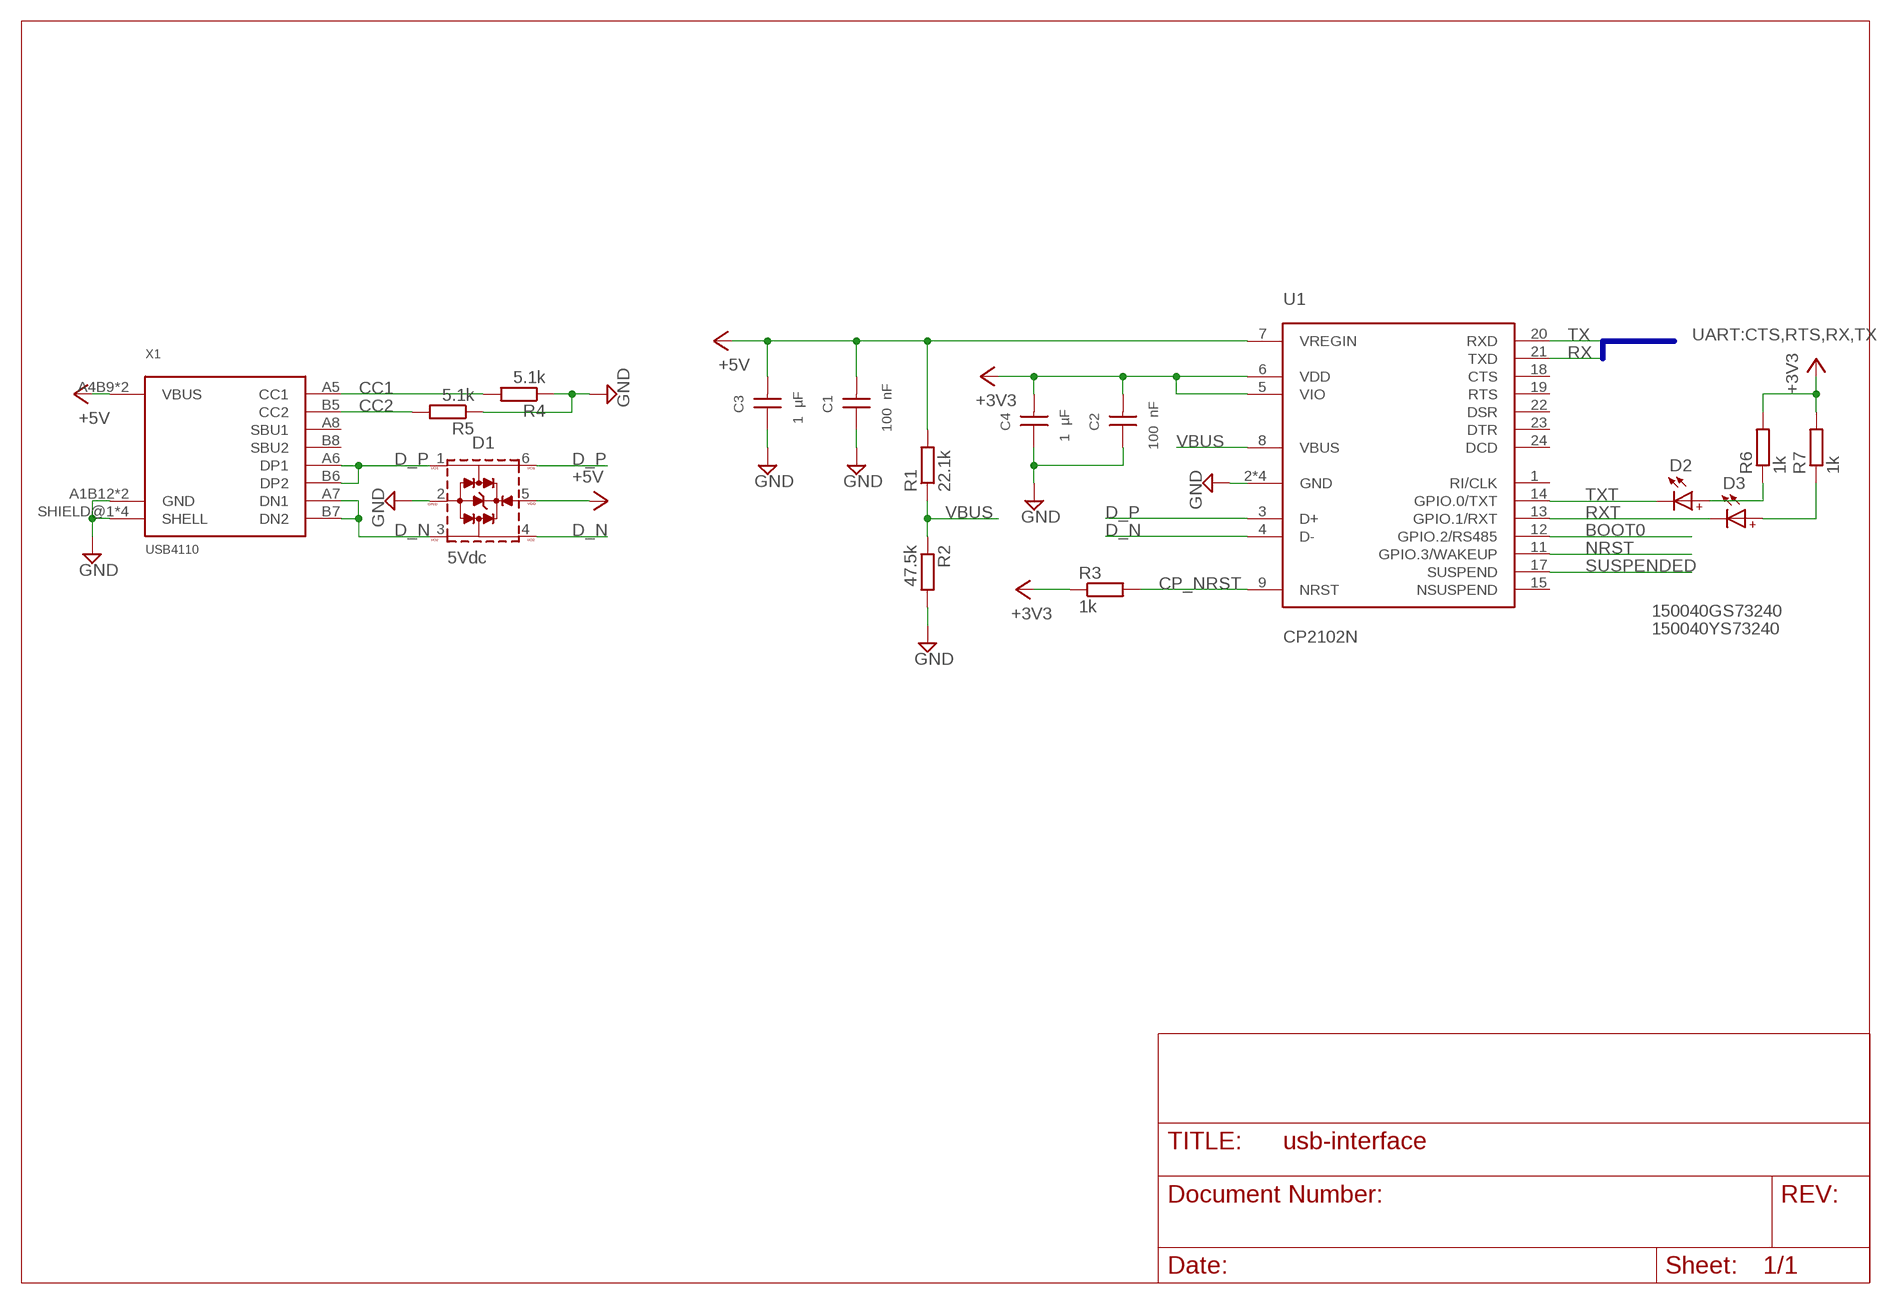
[diagram p5: schematic, module USB, sheet 1]

### Parts
C1  100 nF  WCAP-CSGP_0402_885012105010_10V(DC)  [WCAP-CSGP_0402]
C2  100 nF  WCAP-CSGP_0402_885012105010_10V(DC)  [WCAP-CSGP_0402]
C3  1 µF  WCAP-CSGP_0402_885012105012_10V(DC)  [WCAP-CSGP_0402]
C4  1 µF  WCAP-CSGP_0402_885012105012_10V(DC)  [WCAP-CSGP_0402]
D1  5Vdc  WE-TVS-HS_SOT563_82400152  [WE-TVS_SOT563]
D2  150040GS73240  WL-SMCC_0402_150040GS73240  [WL-SMCC_0402]
D3  150040YS73240  WL-SMCC_0402_150040YS73240  [WL-SMCC_0402]
R1  22.1k  R-EU_R0402  [R0402]
R2  47.5k  R-EU_R0402  [R0402]
R3  1k  R-EU_R0402  [R0402]
R4  5.1k  R-EU_R0402  [R0402]
R5  5.1k  R-EU_R0402  [R0402]
R6  1k  R-EU_R0402  [R0402]
R7  1k  R-EU_R0402  [R0402]
U1  CP2102N  CP2102NQFN24  [QFN50P400X400X80-25T255N]
X1  USB4110  USBC-USB4110USBC  [USBCGCT]

### Nets
+3V3: C2.2 C4.2 R3.1 R6.2 R7.2 U1.5(VIO) U1.6(VDD)
+5V: C1.2 C3.2 D1.5(VDD) R1.2 U1.7(VREGIN) X1.A4B9(VBUS) X1.B4A9(VBUS)
BOOT0: U1.12(GPIO.2/RS485)
CC1: R4.2 X1.A5(CC1)
CC2: R5.2 X1.B5(CC2)
CP_NRST: R3.2 U1.9(NRST)
D_N [differential]: D1.3(I/O2) D1.4(I/O4) U1.4(D-) X1.A7(DN1) X1.B7(DN2)
D_P [differential]: D1.1(I/O1) D1.6(I/O3) U1.3(D+) X1.A6(DP1) X1.B6(DP2)
GND: C1.1 C2.1 C3.1 C4.1 D1.2(GND) R2.2 R4.1 R5.1 U1.2(GND) U1.25(GND) U1.P$1(GND) U1.P$2(GND) X1.A1B12(GND) X1.B1A12(GND) X1.SHIELD@1(SHELL) X1.SHIELD@2(SHELL) X1.SHIELD@3(SHELL) X1.SHIELD@4(SHELL)
N$1: D3.2(A) R7.1
N$2: D2.2(A) R6.1
NRST: U1.11(GPIO.3/WAKEUP)
RX: U1.21(TXD)
RXT: D3.1(C) U1.13(GPIO.1/RXT)
SUSPENDED: U1.17(SUSPEND)
TX: U1.20(RXD)
TXT: D2.1(C) U1.14(GPIO.0/TXT)
VBUS: R1.1 R2.1 U1.8(VBUS)
Unconnected: U1.1(RI/CLK) U1.15(NSUSPEND) U1.18(CTS) U1.19(RTS) U1.22(DSR) U1.23(DTR) U1.24(DCD) X1.A8(SBU1) X1.B8(SBU2)

### Buses
UART:CTS,RTS,RX,TX

### Library data of the parts
C1 C2 = Wurth_Capacitors_WCAP-CSGP:WCAP-CSGP_0402: WCAP-CSGP MLCCs 0402 General Purpose Characteristics High performance ceramic High electrical precision and stability ceramic especially for NP0 Minimal aging especially for NP0 Mounting style: SMT-Chip Ceramic: NP0 (Class I), X5R (Class II), X7R (Class II) Capacitance range: 1 pF ‒ 10 µF Temperature Coefficient: ±30 ppm/°C; ±0.54 % for NP0 ±15 % for X5R and X7R Voltage range (UR): 6.3 ‒ 100 V(DC) Operating temperature: -55 °C up to + 125 °C for NP0 and X7R -55 °C up to + 85 °C for X5R Termination: Cu/Ni/Sn Recommended soldering: Reflow soldering Applications Temperature compensation (NP0) Coupling Decoupling Bypass Smoothing Filtering Resonant circuit <https://www.we-online.com/catalog/media/o157810v209%20Family_WE-MLCC_0805_weiss.jpg> Details see: https://www.we-online.com/catalog/en/WCAP-CSGP-0402/ Updated by yingchun,Shan;2020-03-06 2020(C) Würth Elektronik; CERAMIC-TYPE: X5R Class II; DATASHEET-URL: https://www.we-online.com/catalog/datasheet/885012105010.pdf; DF: 5%; H: 0.5mm; OPERATING-TEMPERATURE: -55 °C up to +85 °C; PART-NUMBER: 885012105010; QMIN: -; RISO: 5GOhm; TECHNICAL-REFERENCE: X5R0402104M010DFCT10000; TOL-VALUE: ±20%; VR: 10V(DC)
C3 C4 = Wurth_Capacitors_WCAP-CSGP:WCAP-CSGP_0402: WCAP-CSGP MLCCs 0402 General Purpose Characteristics High performance ceramic High electrical precision and stability ceramic especially for NP0 Minimal aging especially for NP0 Mounting style: SMT-Chip Ceramic: NP0 (Class I), X5R (Class II), X7R (Class II) Capacitance range: 1 pF ‒ 10 µF Temperature Coefficient: ±30 ppm/°C; ±0.54 % for NP0 ±15 % for X5R and X7R Voltage range (UR): 6.3 ‒ 100 V(DC) Operating temperature: -55 °C up to + 125 °C for NP0 and X7R -55 °C up to + 85 °C for X5R Termination: Cu/Ni/Sn Recommended soldering: Reflow soldering Applications Temperature compensation (NP0) Coupling Decoupling Bypass Smoothing Filtering Resonant circuit <https://www.we-online.com/catalog/media/o157810v209%20Family_WE-MLCC_0805_weiss.jpg> Details see: https://www.we-online.com/catalog/en/WCAP-CSGP-0402/ Updated by yingchun,Shan;2020-03-06 2020(C) Würth Elektronik; CERAMIC-TYPE: X5R Class II; DATASHEET-URL: https://www.we-online.com/catalog/datasheet/885012105012.pdf; DF: 15%; H: 0.5mm; OPERATING-TEMPERATURE: -55 °C up to +85 °C; PART-NUMBER: 885012105012; QMIN: -; RISO: 0.05GOhm; TECHNICAL-REFERENCE: X5R0402105M010DFCT10000; TOL-VALUE: ±20%; VR: 10V(DC)
D1 = Wurth_EMC Components_WE-TVS:WE-TVS-HS_SOT563_82400152: WE-TVS TVS Diode – High Speed Series Characteristics Low clamping voltage Sturdy design Very low capacitance Flow Thru Design for a simple layout Rail to Rail protection Epoxy flame resistant UL94-V0 RoHS, REACH and free of halogens Applications Very fast data lines USB 2.0 Ethernet PoE VGA Sim Cards Keypads HS = High Speed <https://katalog.we-online.com/media/images/v2/o14883v209%20Family_WE-TVS_HIGHSPEED.> Details see: https://katalog.we-online.com/en/pbs/WE-TVS-HS Updated by Ella Wu 2019-07-12 2019 (C) Wurth Elektronik; C-CH: 2pF; CHANNELS: 2+1; DATASHEET-URL: https://www.we-online.com/catalog/datasheet/82400152.pdf; IPEAK: 6A; MOUNT: SMT; PART-NUMBER: 82400152; VBR: 6V
D2 D3 = Wurth_Elektronik_Optoelectronics_rev19b:WL-SMCC_0402: WL-SMCC SMD Mono-color Chip LED Compact Characteristics Compatible to IR reflow soldering Miniaturized color effect Size 0402 Super thin Chip LED of 0.4 mm with exceptional brightness Industry standard footprint Waterclear lens High reliabilit Applications Front panel backlighting Navigation and LCD backlighting Size 0402 Cellphone display Display for industrial control systems Traffic display <http://katalog.we-online.de/media/images/v2/Family_WL-SMCC_neu.jpg> Details see: http://katalog.we-online.de/en/led/WL-SMCC?m Created By Yingchun Shan 2018-03-09 2018 (C) Wurth Elektronik
R1-R7 = rcl:R-EU_: RESISTOR, European symbol; SPICEPREFIX: R
U1 = spectrometer:CP2102N: CP2102N The Universal Serial Bus function controller in the CP2102N is a USB 2.0 compliant full-speed device with integrated transceiver and on-chip matching and pull-up resistors. The USB function controller manages all data transfers between the USB and the UART as well as command requests generated by the USB host controller and commands for controlling the function of the UART. The USB Suspend and Resume signals are supported for power management of both the CP2102N device as well as external circuitry. The CP2102N will enter Suspend mode when Suspend signaling is detected on the bus. On entering Suspend mode, the CP2102N asserts the SUSPEND and SUSPENDb signals. SUSPEND and SUSPENDb are also asserted after a CP2102N reset until device configuration during USB Enumeration is complete. The CP2102N exits Suspend mode when any of the following occur: 1. Resume signaling is detected or generated. 2. A USB Reset signal is detected. 3. A device reset occurs. 4. USB Remote Wakeup functionality is enabled and the WAKEUP pin is grounded. On exit of Suspend mode, the SUSPEND and SUSPENDb signals are de-asserted. Both SUSPEND and SUSPENDb temporarily float high during a CP2102N reset. If this behavior is undesirable, a strong pull-down (10 kΩ) can be used to ensure SUSPENDb remains low during reset.
X1 = connectors:USBC-USB4110: USB Type C Receptacle

## Module INTERFACE
Ports: GND(io) +3V3(io) SWITCH(io) RED(io) GREEN(io) BLUE(io)
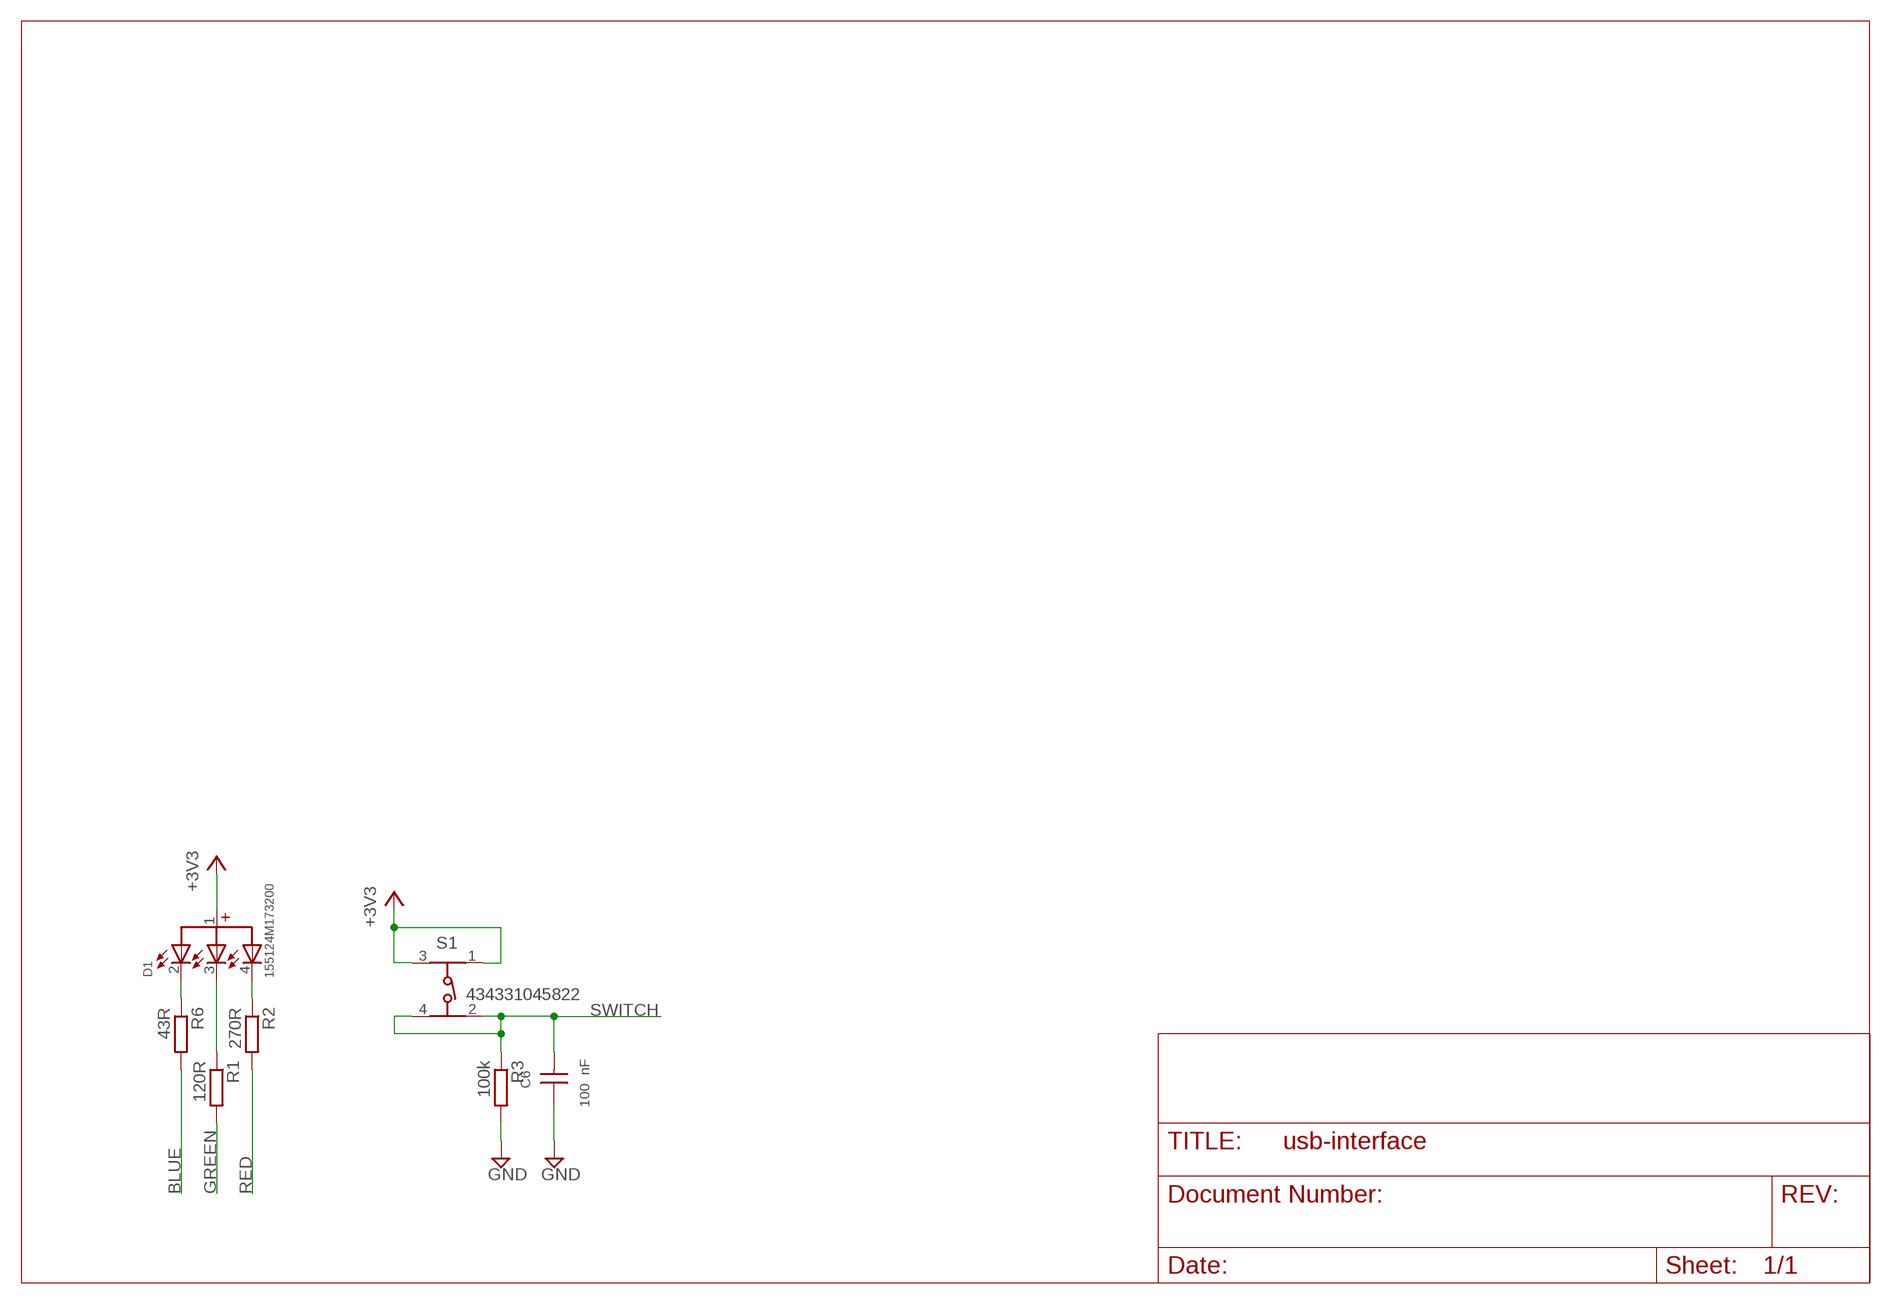
[diagram p6: schematic, module INTERFACE, sheet 1]

### Parts
C6  100 nF  WCAP-CSGP_0402_885012105010_10V(DC)  [WCAP-CSGP_0402]
D1  155124M173200  WL-SFSW_1204_155124M173200  [WL-SFSW_1204]
R1  120R  R-EU_R0402  [R0402]
R2  270R  R-EU_R0402  [R0402]
R3  100k  R-EU_R0402  [R0402]
R6  43R  R-EU_R0402  [R0402]
S1  434331045822  [4343X10458XX]

### Nets
+3V3: D1.1 S1.1 S1.3
BLUE: R6.2
GND: C6.1 R3.2
GREEN: R1.2
N$1: D1.2 R6.1
N$2: D1.3 R1.1
N$3: D1.4 R2.1
RED: R2.2
SWITCH: C6.2 R3.1 S1.2 S1.4

### Library data of the parts
C6 = Wurth_Capacitors_WCAP-CSGP:WCAP-CSGP_0402: WCAP-CSGP MLCCs 0402 General Purpose Characteristics High performance ceramic High electrical precision and stability ceramic especially for NP0 Minimal aging especially for NP0 Mounting style: SMT-Chip Ceramic: NP0 (Class I), X5R (Class II), X7R (Class II) Capacitance range: 1 pF ‒ 10 µF Temperature Coefficient: ±30 ppm/°C; ±0.54 % for NP0 ±15 % for X5R and X7R Voltage range (UR): 6.3 ‒ 100 V(DC) Operating temperature: -55 °C up to + 125 °C for NP0 and X7R -55 °C up to + 85 °C for X5R Termination: Cu/Ni/Sn Recommended soldering: Reflow soldering Applications Temperature compensation (NP0) Coupling Decoupling Bypass Smoothing Filtering Resonant circuit <https://www.we-online.com/catalog/media/o157810v209%20Family_WE-MLCC_0805_weiss.jpg> Details see: https://www.we-online.com/catalog/en/WCAP-CSGP-0402/ Updated by yingchun,Shan;2020-03-06 2020(C) Würth Elektronik; CERAMIC-TYPE: X5R Class II; DATASHEET-URL: https://www.we-online.com/catalog/datasheet/885012105010.pdf; DF: 5%; H: 0.5mm; OPERATING-TEMPERATURE: -55 °C up to +85 °C; PART-NUMBER: 885012105010; QMIN: -; RISO: 5GOhm; TECHNICAL-REFERENCE: X5R0402104M010DFCT10000; TOL-VALUE: ±20%; VR: 10V(DC)
D1 = Wurth_Elektronik_Optoelectronics_rev19b:WL-SFSW_1204: WL-SFSW SMD Full-color Side view Waterclear Characteristics Common anode Small 1204 side view package with high intensity output Industry standard package with multiple chips Standard industrial footprint Compatible with reflow soldering and pick and place machine Applications Backlighting Status indicator Front panel indicator Office automation, home appliances, industrial equipment Side-lighting application <http://katalog.we-online.de/media/images/v2/Family_WL-SFSW_1204.jpg> Details see: http://katalog.we-online.de/en/led/WL-SFSW Updated 2017-04-14 2017 (C) Wurth Elektronik
R1-R3 R6 = rcl:R-EU_: RESISTOR, European symbol; SPICEPREFIX: R
S1 = Wurth_Switch_WS-TASU:434331045822: WS-TASU SMT Tact Switch 4.7x3.5 mm side push MATERIAL PROPERTIES Cover Material:Stainless Steel PROPERTIES Actuator Material:PA46 Actuator Flammability Rating: UL94 HB Actuator Color: Black; White Frame Material: PA46 Frame Flammability: UL94 HB Frame Color:White Contact Material Stainless Steel Contact Plating Silver Terminal Material Copper Alloy Terminal Plating Silver VR 12 V (DC) Contact Resistance Initial 100 mΩ Contact Resistance After Life Test 1 Ω RISO 100 MΩ Withstanding Voltage 250 V (AC) Washable No Qty. 3300 GENERAL INFORMATION Operating Temperature -40 up to +85 °C Washable:No PACKAGING PROPERTIES Packaging Tape and Reel <https://www.we-online.com/catalog/media/o61072v209%20Family_WS_TUS_Normal_SMD_Side-Push_4343x10458xx_pf2.jpg> Details see: https://www.we-online.com/catalog/en/TASU_3_5X4_7_SMD_SIDE_PUSH/ Updated by Yingchun, Shan 2020-02-17 2020(C) Wurth Elektronik; DATASHEET-URL: https://www.we-online.com/catalog/datasheet/434331045822.pdf; H: 1.65mm; OPERATION-FORCE: 220g; PART-NUMBER: 434331045822; QTY: 3300

## Net classes
0 default: width 0.1 mm, drill 0.2 mm, clearance 0.1 mm
1 50Ohm: width 0.29 mm, clearance 0.2 mm